# EAGLE schematic qorvo_885071-A_eval (EAGLE 8.5.1)
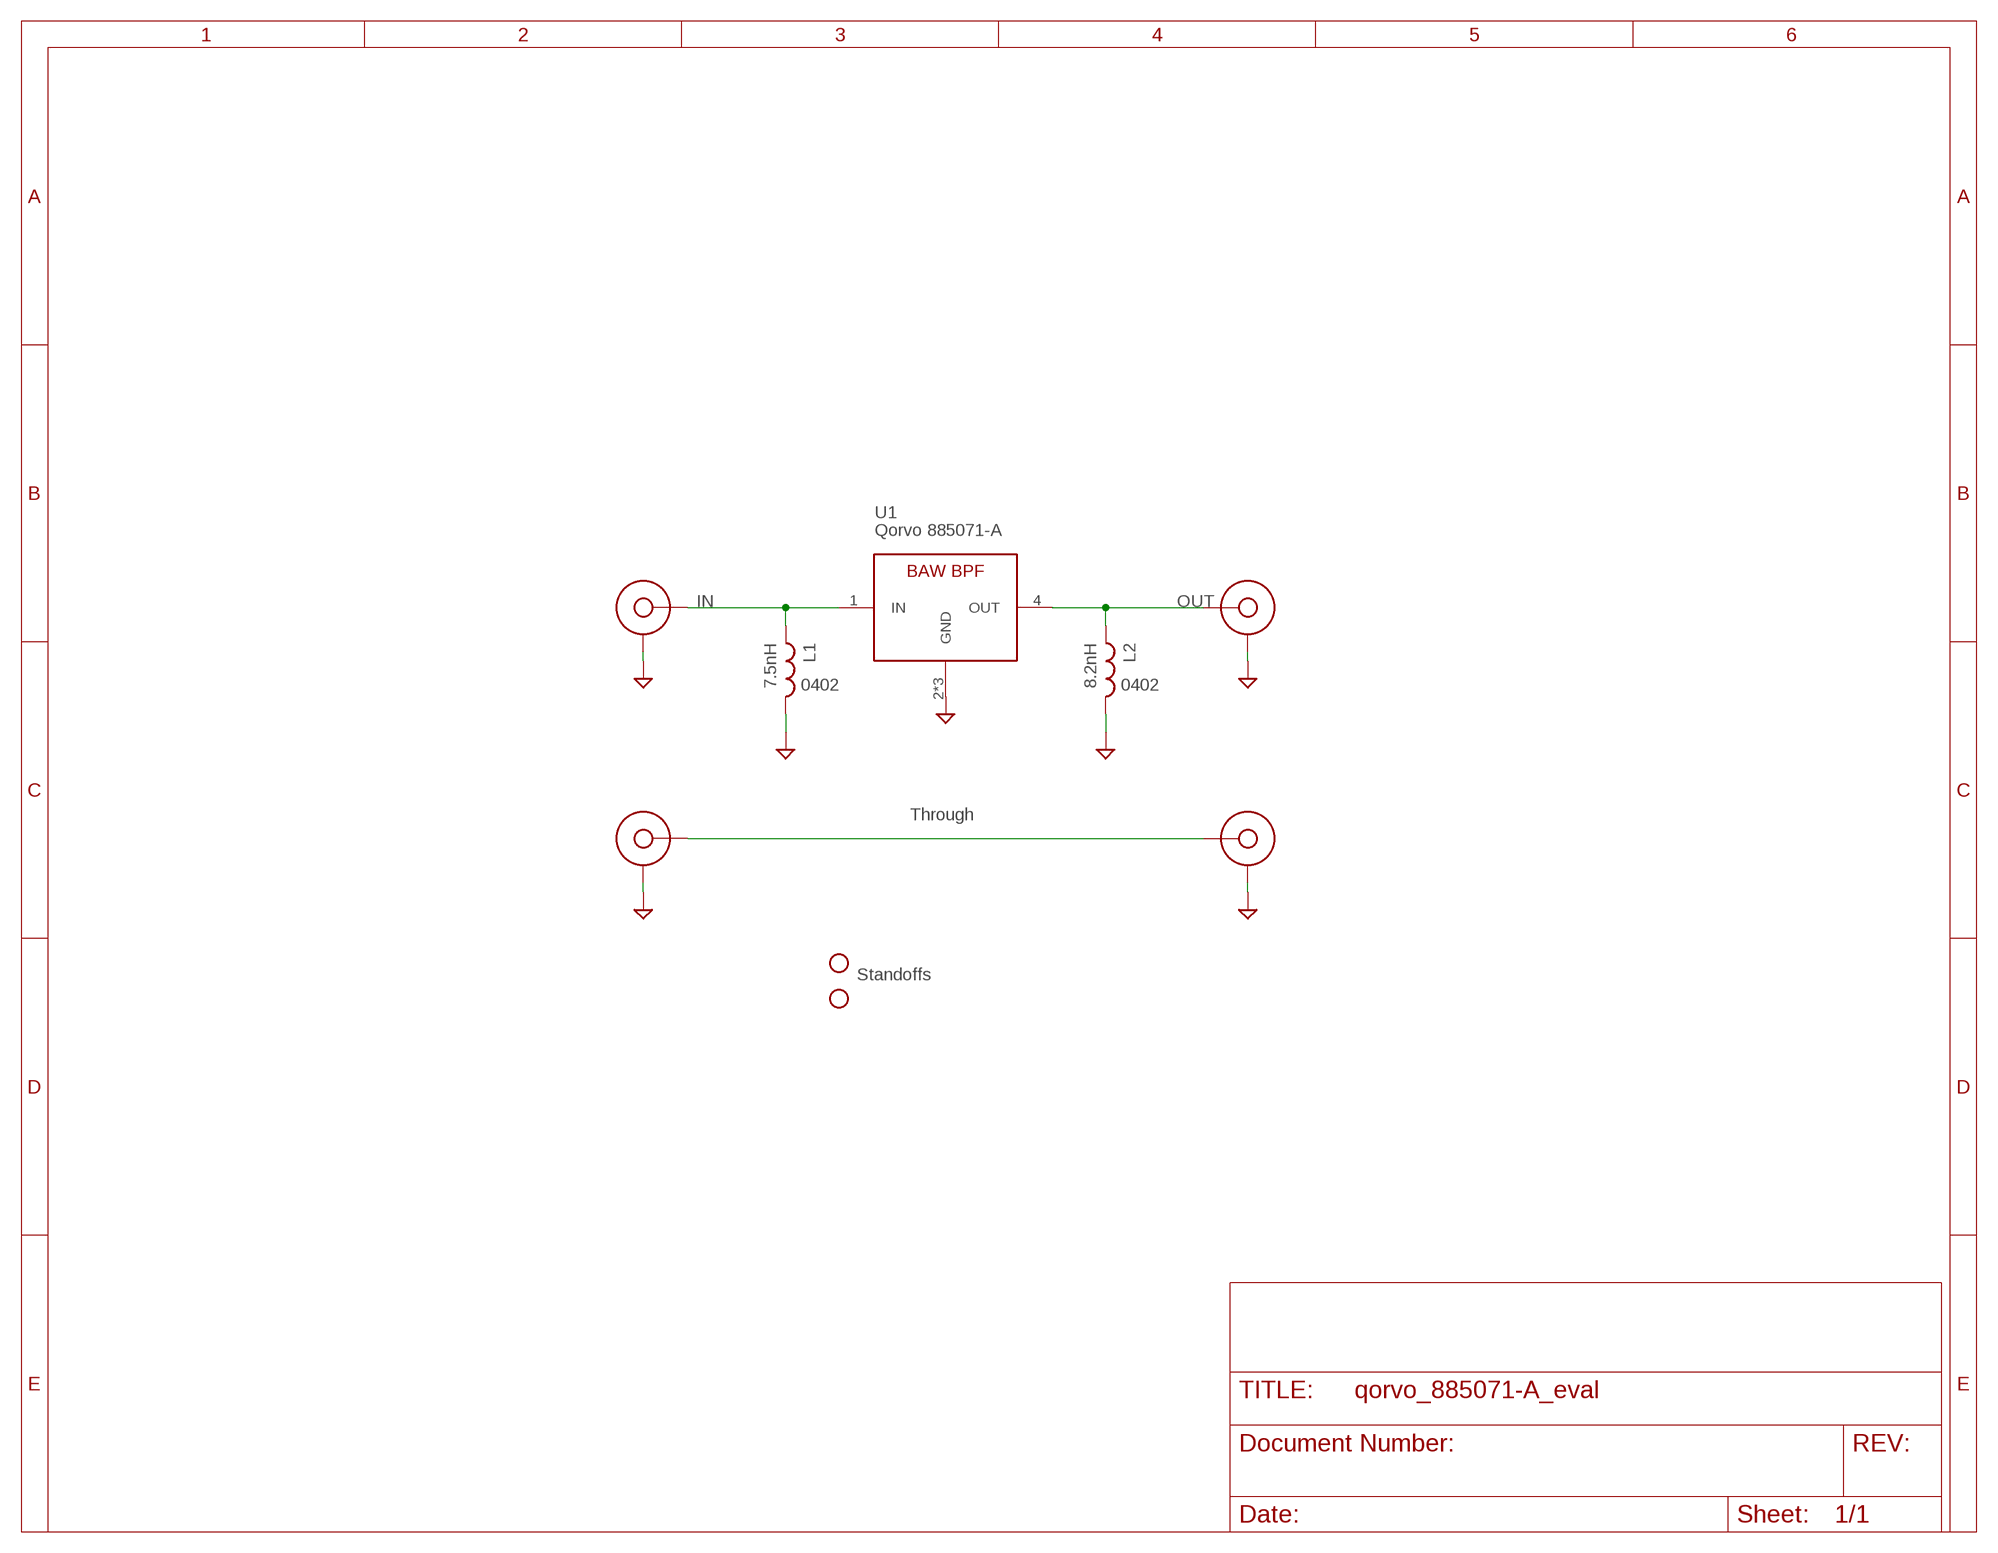
[diagram p0: schematic, sheet 1]

## Parts
CF1  SMA-CINCH-END-FIRE  [SMAJ716-ND]
CF2  SMA-CINCH-END-FIRE  [SMAJ716-ND]
CF3  SMA-CINCH-END-FIRE  [SMAJ716-ND]
CF4  SMA-CINCH-END-FIRE  [SMAJ716-ND]
H1  STAND-OFFTIGHT  [STAND-OFF-TIGHT]
H2  STAND-OFFTIGHT  [STAND-OFF-TIGHT]
L1  7.5nH  L-US0402-B-NOSILK  [.0402-B-NOSILK]
L2  8.2nH  L-US0402-B-NOSILK  [.0402-B-NOSILK]
U1  885071-A  [FIL_B39162B9417K610]

## Nets
GND: CF1.GND1(GND) CF1.GND2(GND) CF1.GND3(GND) CF1.GND4(GND) CF2.GND1(GND) CF2.GND2(GND) CF2.GND3(GND) CF2.GND4(GND) CF3.GND1(GND) CF3.GND2(GND) CF3.GND3(GND) CF3.GND4(GND) CF4.GND1(GND) CF4.GND2(GND) CF4.GND3(GND) CF4.GND4(GND) L1.2 L2.2 U1.2(GND) U1.3(GND) U1.5(GND)
IN [RF]: CF1.P$3(CENTERCONDUCTOR) L1.1 U1.1(IN)
OUT [RF]: CF3.P$3(CENTERCONDUCTOR) L2.1 U1.4(OUT)
THROUGH [RF]: CF2.P$3(CENTERCONDUCTOR) CF4.P$3(CENTERCONDUCTOR)

## Notes on the sheet
- Qorvo 885071-A
- 0402 | 0402
- Through
- Standoffs

## Library data of the parts
CF1-CF4 = psas_c3_team05:SMA-CINCH-END-FIRE
H1 H2 = SparkFun-Hardware:STAND-OFF: Stand Off Drill holes for mechanically mounting via screws, standoffs, etc. Note: Use the keepout ring to avoid running the screw head into surrounding components. Variant Overviews STAND-OFF - Mechanical footprint for a #4 phillips button head screw. STAND-OFF-TIGHT - Mechanical footprint for a #4 phillips button head screw, Example SparkFun Products Screw - Phillips Head (1/4", 4-40, 10 pack) <https://www.sparkfun.com/products/10453> (PRT-10453) Screw - Phillips Head (1/2", 4-40, 10 pack) <https://www.sparkfun.com/products/10452> (PRT-10452) Screw - Phillips Head (3/4", 4-40, 10 pack) <https://www.sparkfun.com/products/10451> (PRT-10451) Screw - Phillips Head (1", 4-40, 10 pack) <https://www.sparkfun.com/products/10450> (PRT-10450)
L1 L2 = rcl_custom:L-US: INDUCTOR, American symbol
U1 = 885071_A:885071-A: 2.4GHz BPF

## Net classes
1 RF: width 0.33 mm, clearance 0.34 mm